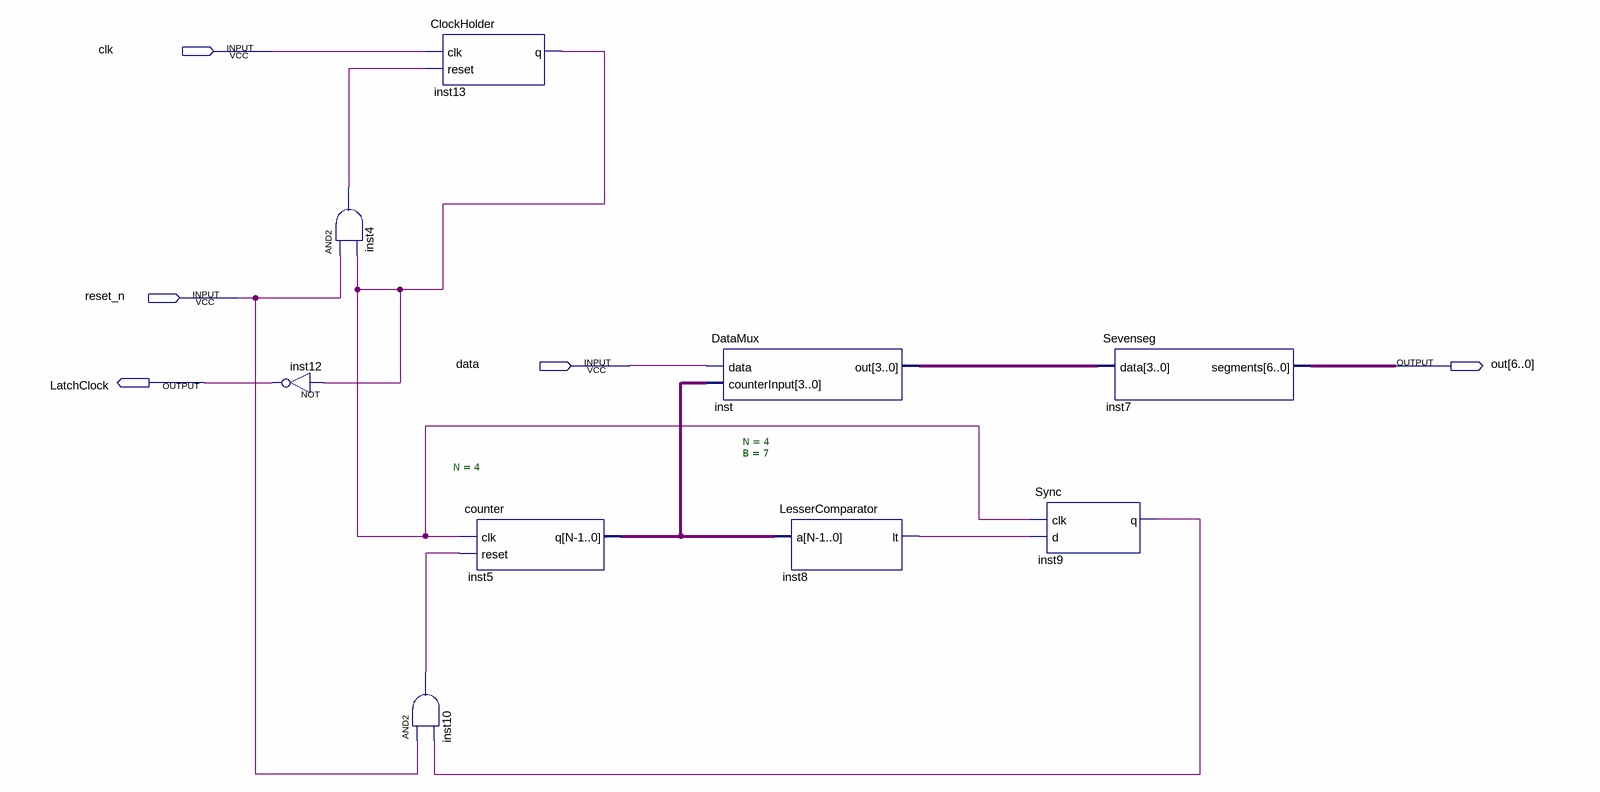
[diagram p0: schematic sheet]
// Quartus schematic NESreciever.bdf as structural Verilog: 9 symbols, 5 pins
module NESreciever (
  input  clk,
  input  reset_n,
  input  data,
  output [6:0] out,
  output LatchClock
);

  wire inst4_out, inst8_lt, inst9_q, inst10_out, inst13_q;
  wire [3:0] inst5_q, inst_out;

  not inst12 (LatchClock, inst13_q);
  and inst4 (inst4_out, reset_n, inst13_q);
  ClockHolder inst13 (.clk(clk), .reset(inst4_out), .q(inst13_q));
  and inst10 (inst10_out, reset_n, inst9_q);
  counter #(.N(4)) inst5 (.clk(inst13_q), .reset(inst10_out), .q(inst5_q));
  DataMux inst (.data(data), .counterInput(inst5_q), .out(inst_out));
  LesserComparator #(.N(4), .B(7)) inst8 (.a(inst5_q), .lt(inst8_lt));
  Sync inst9 (.clk(inst13_q), .d(inst8_lt), .q(inst9_q));
  Sevenseg inst7 (.data(inst_out), .segments(out));
endmodule
